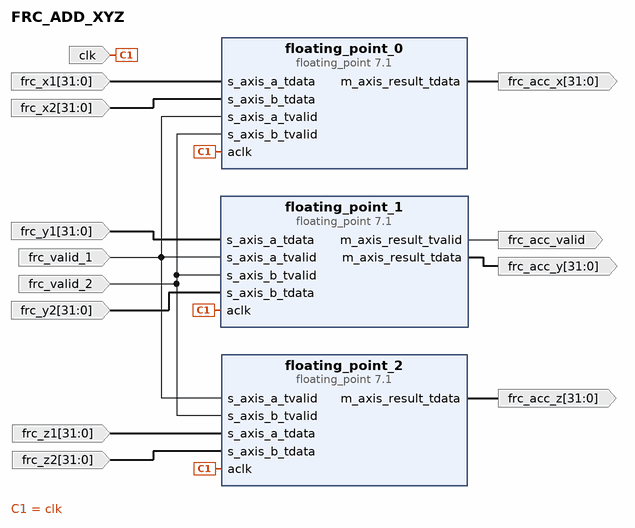
[diagram p0: block diagram of the top level]
# Vivado block design FRC_ADD_XYZ, xcu280-fsvh2892-2L-e, Vivado 2021.2
create_bd_design FRC_ADD_XYZ

create_bd_port -dir I -type clk clk
set_property -dict {CONFIG.FREQ_HZ 10000000} [get_bd_ports clk]
create_bd_port -dir O frc_acc_valid
create_bd_port -dir O -from 31 -to 0 frc_acc_x
create_bd_port -dir O -from 31 -to 0 frc_acc_y
create_bd_port -dir O -from 31 -to 0 frc_acc_z
create_bd_port -dir I frc_valid_1
create_bd_port -dir I frc_valid_2
create_bd_port -dir I -from 31 -to 0 frc_x1
create_bd_port -dir I -from 31 -to 0 frc_x2
create_bd_port -dir I -from 31 -to 0 frc_y1
create_bd_port -dir I -from 31 -to 0 frc_y2
create_bd_port -dir I -from 31 -to 0 frc_z1
create_bd_port -dir I -from 31 -to 0 frc_z2

create_bd_cell -type ip -vlnv xilinx.com:ip:floating_point:7.1 floating_point_0
set_property -dict [list \
  CONFIG.Add_Sub_Value Add \
  CONFIG.C_Latency 3 \
  CONFIG.Flow_Control NonBlocking \
  CONFIG.Has_RESULT_TREADY false \
  CONFIG.Maximum_Latency false \
] [get_bd_cells floating_point_0]
create_bd_cell -type ip -vlnv xilinx.com:ip:floating_point:7.1 floating_point_1
set_property -dict [list \
  CONFIG.Add_Sub_Value Add \
  CONFIG.C_Latency 3 \
  CONFIG.Flow_Control NonBlocking \
  CONFIG.Has_RESULT_TREADY false \
  CONFIG.Maximum_Latency false \
] [get_bd_cells floating_point_1]
create_bd_cell -type ip -vlnv xilinx.com:ip:floating_point:7.1 floating_point_2
set_property -dict [list \
  CONFIG.Add_Sub_Value Add \
  CONFIG.C_Latency 3 \
  CONFIG.Flow_Control NonBlocking \
  CONFIG.Has_RESULT_TREADY false \
  CONFIG.Maximum_Latency false \
] [get_bd_cells floating_point_2]

# ---- connections ----

connect_bd_net -net aclk_0_1 [get_bd_ports clk] \
  [get_bd_pins floating_point_0/aclk] [get_bd_pins floating_point_1/aclk] [get_bd_pins floating_point_2/aclk]
connect_bd_net [get_bd_pins floating_point_0/m_axis_result_tdata] [get_bd_ports frc_acc_x]
connect_bd_net [get_bd_pins floating_point_1/m_axis_result_tdata] [get_bd_ports frc_acc_y]
connect_bd_net [get_bd_pins floating_point_1/m_axis_result_tvalid] [get_bd_ports frc_acc_valid]
connect_bd_net [get_bd_pins floating_point_2/m_axis_result_tdata] [get_bd_ports frc_acc_z]
connect_bd_net -net s_axis_a_tdata_0_1 [get_bd_ports frc_z1] [get_bd_pins floating_point_2/s_axis_a_tdata]
connect_bd_net -net s_axis_a_tdata_1_1 [get_bd_ports frc_y1] [get_bd_pins floating_point_1/s_axis_a_tdata]
connect_bd_net -net s_axis_a_tdata_2_1 [get_bd_ports frc_x1] [get_bd_pins floating_point_0/s_axis_a_tdata]
connect_bd_net -net s_axis_a_tvalid_0_1 [get_bd_ports frc_valid_1] \
  [get_bd_pins floating_point_0/s_axis_a_tvalid] [get_bd_pins floating_point_1/s_axis_a_tvalid] \
  [get_bd_pins floating_point_2/s_axis_a_tvalid]
connect_bd_net -net s_axis_b_tdata_0_1 [get_bd_ports frc_z2] [get_bd_pins floating_point_2/s_axis_b_tdata]
connect_bd_net -net s_axis_b_tdata_1_1 [get_bd_ports frc_y2] [get_bd_pins floating_point_1/s_axis_b_tdata]
connect_bd_net -net s_axis_b_tdata_2_1 [get_bd_ports frc_x2] [get_bd_pins floating_point_0/s_axis_b_tdata]
connect_bd_net -net s_axis_b_tvalid_0_1 [get_bd_ports frc_valid_2] \
  [get_bd_pins floating_point_0/s_axis_b_tvalid] [get_bd_pins floating_point_1/s_axis_b_tvalid] \
  [get_bd_pins floating_point_2/s_axis_b_tvalid]

validate_bd_design
save_bd_design
